# Altium schematic sheet H-00488 - Release Checklist.SchDoc: Release Checklist
size 403 x 281 mm; DocumentNumber: 2; SheetNumber: 2; SheetTotal: 12
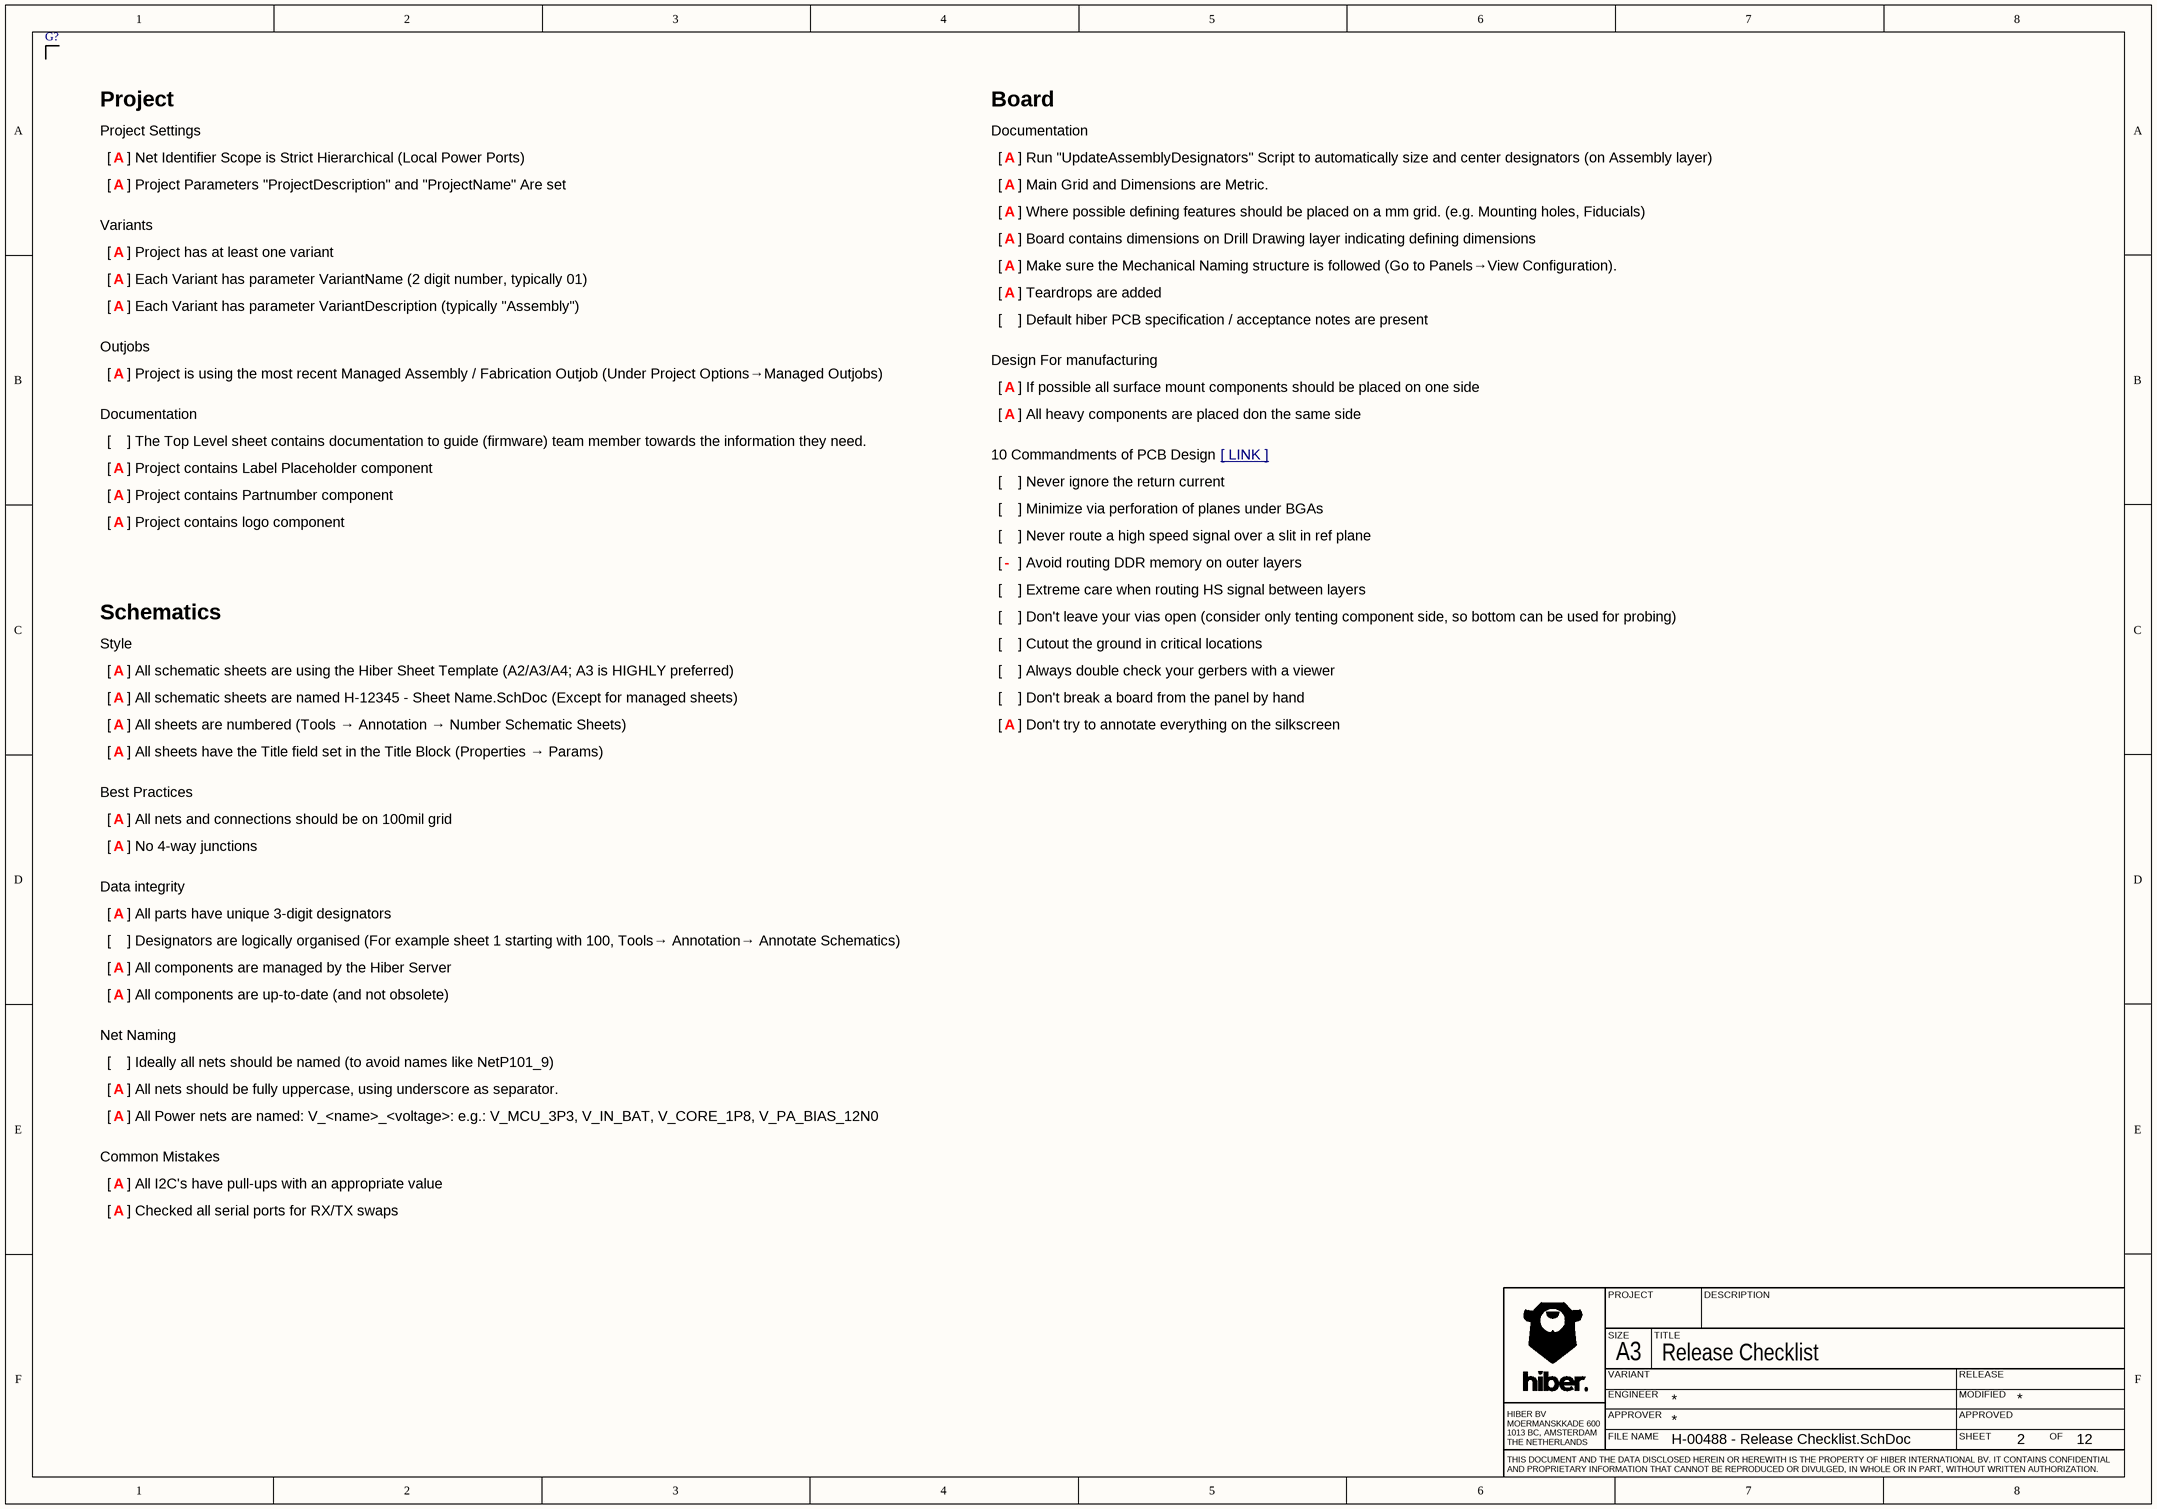
[diagram p0: H-00488 - Release Checklist.SchDoc]

## Parts
G?  CHECKLIST-COMMON  (value not drawn)  (graphical)

## Notes on the sheet
- A
- -
- PROJECT
- DESCRIPTION
- SIZE
- ENGINEER
- VARIANT
- A3
- TITLE
- MODIFIED
- RELEASE
- HIBER BV
  MOERMANSKKADE 600
  1013 BC, AMSTERDAM
  THE NETHERLANDS
- FILE NAME
- APPROVER
- SHEET
- APPROVED
- OF
- THIS DOCUMENT AND THE DATA DISCLOSED HEREIN OR HEREWITH IS THE PROPERTY OF HIBER INTERNATIONAL BV. IT CONTAINS CONFIDENTIAL AND PROPRIETARY INFORMATION THAT CANNOT BE REPRODUCED OR DIVULGED, IN WHOLE OR IN PART, WITHOUT WRITTEN AUTHORIZATION.
- (in symbol CMP-01142-2) Project; Board; Project Settings; Documentation; [    ] Net Identifier Scope is Strict Hierarchical (Local Power Ports); [    ] Run "UpdateAssemblyDesignators" Script to automatically size and center designators (on Assembly layer); [    ] Project Parameters "ProjectDescription" and "ProjectName" Are set; [    ] Main Grid and Dimensions are Metric.; [    ] Where possible defining features should be placed on a mm grid. (e.g. Mounting holes, Fiducials); Variants; [    ] Board contains dimensions on Drill Drawing layer indicating defining dimensions; [    ] Project has at least one variant; [    ] Make sure the Mechanical Naming structure is followed (Go to Panels→View Configuration).; [    ] Each Variant has parameter VariantName (2 digit number, typically 01); [    ] Teardrops are added; [    ] Each Variant has parameter VariantDescription (typically "Assembly"); [    ] Default hiber PCB specification / acceptance notes are present; Outjobs; Design For manufacturing; [    ] Project is using the most recent Managed Assembly / Fabrication Outjob (Under Project Options→Managed Outjobs); [    ] If possible all surface mount components should be placed on one side; [    ] All heavy components are placed don the same side; [    ] The Top Level sheet contains documentation to guide (firmware) team member towards the information they need.; 10 Commandments of PCB Design; [ LINK ]; [    ] Project contains Label Placeholder component; [    ] Never ignore the return current; [    ] Project contains Partnumber component; [    ] Minimize via perforation of planes under BGAs; [    ] Project contains logo component; [    ] Never route a high speed signal over a slit in ref plane; [    ] Avoid routing DDR memory on outer layers; [    ] Extreme care when routing HS signal between layers; Schematics; [    ] Don't leave your vias open (consider only tenting component side, so bottom can be used for probing); Style; [    ] Cutout the ground in critical locations; [    ] All schematic sheets are using the Hiber Sheet Template (A2/A3/A4; A3 is HIGHLY preferred); [    ] Always double check your gerbers with a viewer; [    ] All schematic sheets are named H-12345 - Sheet Name.SchDoc (Except for managed sheets); [    ] Don't break a board from the panel by hand; [    ] All sheets are numbered (Tools → Annotation → Number Schematic Sheets); [    ] Don't try to annotate everything on the silkscreen; [    ] All sheets have the Title field set in the Title Block (Properties → Params); Best Practices; [    ] All nets and connections should be on 100mil grid; [    ] No 4-way junctions; Data integrity; [    ] All parts have unique 3-digit designators; [    ] Designators are logically organised (For example sheet 1 starting with 100, Tools→ Annotation→ Annotate Schematics); [    ] All components are managed by the Hiber Server; [    ] All components are up-to-date (and not obsolete); Net Naming; [    ] Ideally all nets should be named (to avoid names like NetP101_9); [    ] All nets should be fully uppercase, using underscore as separator.; [    ] All Power nets are named: V_<name>_<voltage>: e.g.: V_MCU_3P3, V_IN_BAT, V_CORE_1P8, V_PA_BIAS_12N0; Common Mistakes; [    ] All I2C's have pull-ups with an appropriate value; [    ] Checked all serial ports for RX/TX swaps

## Library data of the parts
G? = CMP-01142-2